# EAGLE design Adafruit MAX31850 (EAGLE 6.3)
AUTHOR: KTOWN
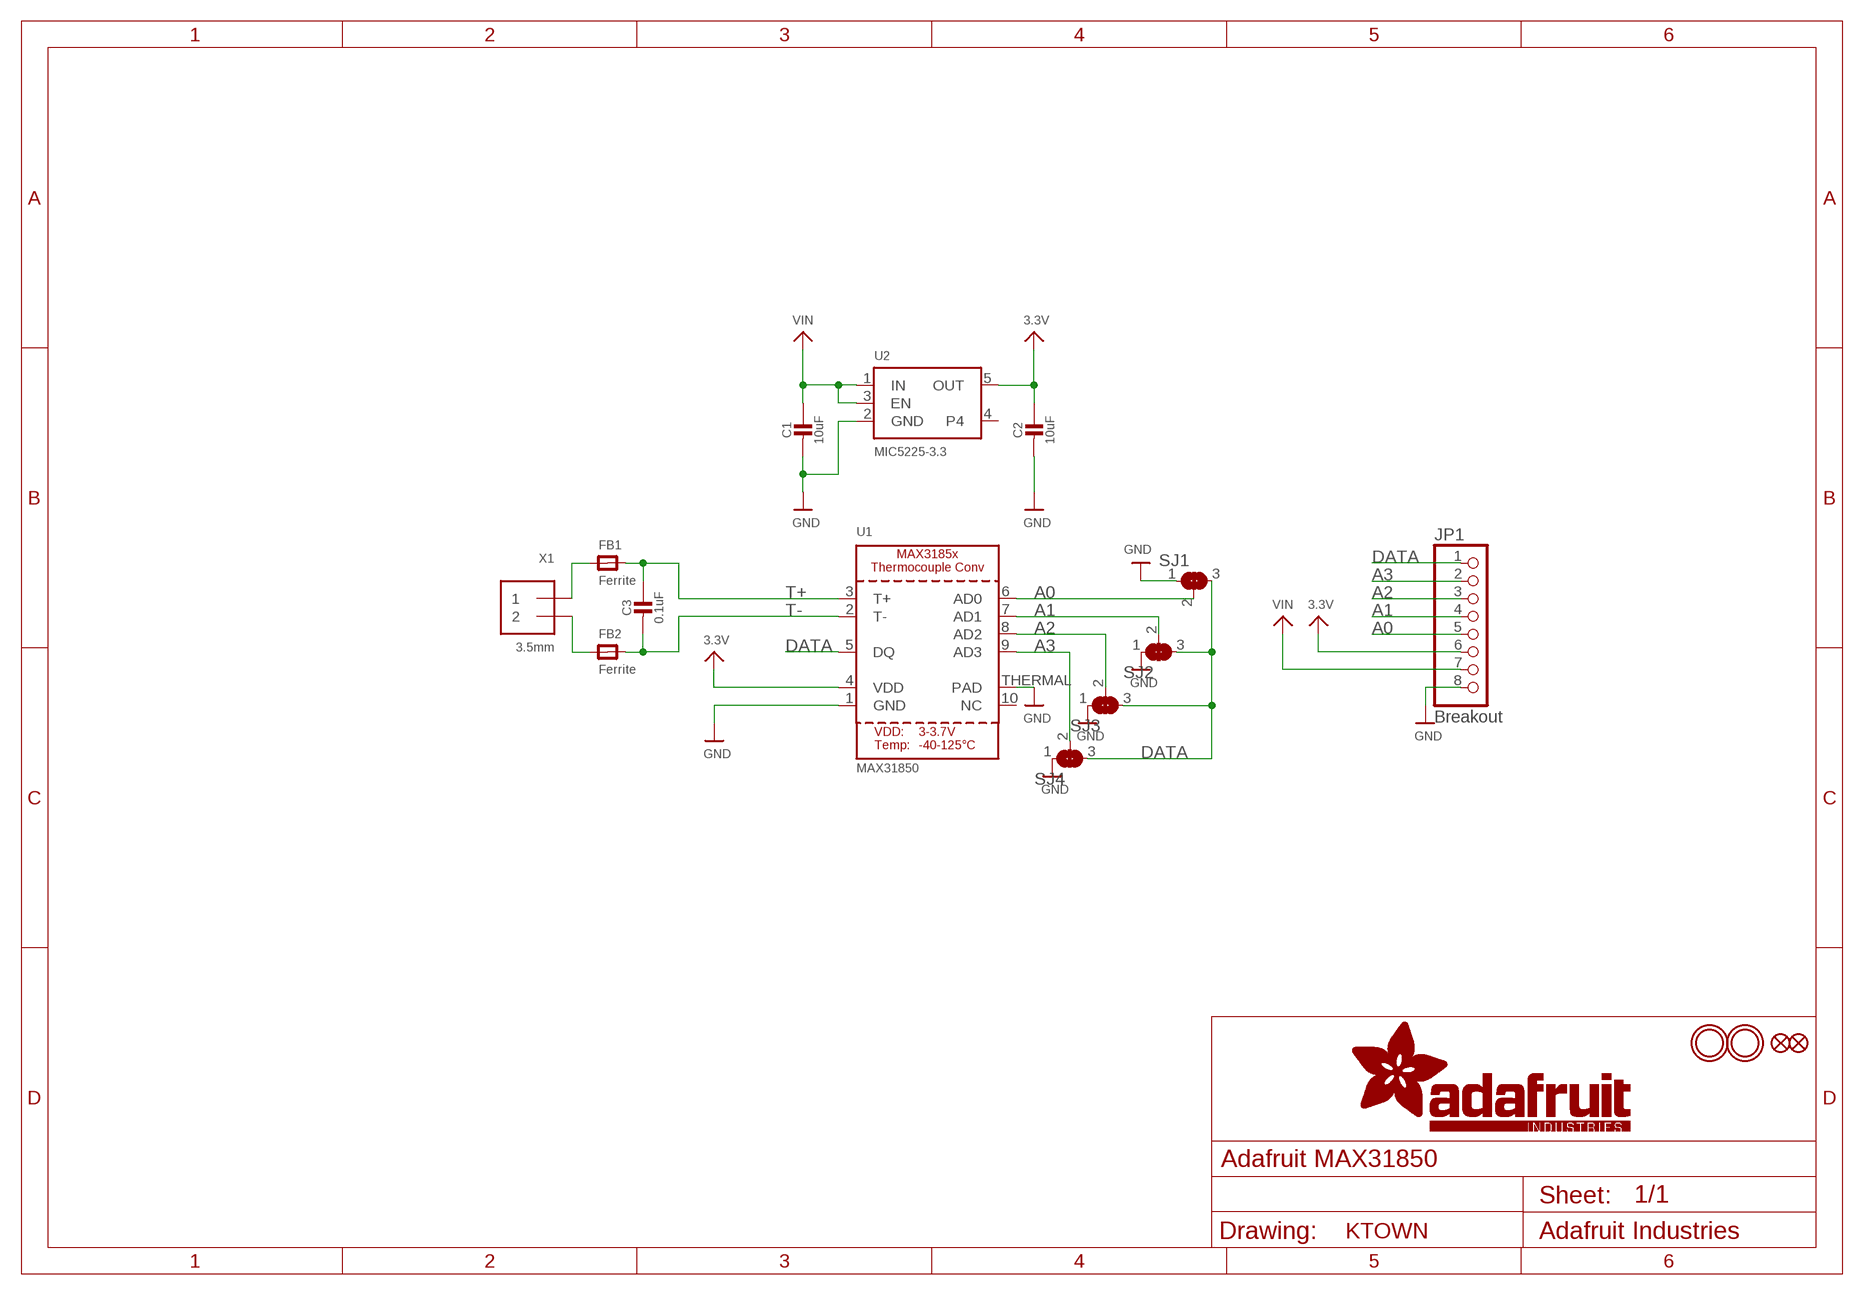
[diagram p0: schematic, sheet 1]

## Parts
C1  10uF  CAP_CERAMIC0805-NOOUTLINE  [0805-NO]
C2  10uF  CAP_CERAMIC0805-NOOUTLINE  [0805-NO]
C3  0.1uF  CAP_CERAMIC0805-NOOUTLINE  [0805-NO]
FB1  Ferrite  FERRITE0805  [0805]
FB2  Ferrite  FERRITE0805  [0805]
FID1  FIDUCIAL""  [FIDUCIAL_1MM]
FID2  FIDUCIAL""  [FIDUCIAL_1MM]
JP1  Breakout  HEADER-1X870MIL  [1X08_ROUND_70]
SJ1  SOLDERJUMPER_2WAY  [SOLDERJUMPER_2WAY_OPEN_NOPASTE]
SJ2  SOLDERJUMPER_2WAY  [SOLDERJUMPER_2WAY_OPEN_NOPASTE]
SJ3  SOLDERJUMPER_2WAY  [SOLDERJUMPER_2WAY_OPEN_NOPASTE]
SJ4  SOLDERJUMPER_2WAY  [SOLDERJUMPER_2WAY_OPEN_NOPASTE]
U1  MAX31850  MAX3185X  [TDFN10_3X4MM]
U2  MIC5225-3.3  VREG_SOT23-5  [SOT23-5]
U$8  MOUNTINGHOLE2.5  [MOUNTINGHOLE_2.5_PLATED]
U$9  MOUNTINGHOLE2.5  [MOUNTINGHOLE_2.5_PLATED]
X1  3.5mm  TERMBLOCK_1X2  [TERMBLOCK_1X2-3.5MM]

## Nets
3.3V: C2.1 JP1.6 U1.4(VDD) U2.5(OUT)
A0: JP1.5 SJ1.2 U1.6(AD0)
A1: JP1.4 SJ2.2 U1.7(AD1)
A2: JP1.3 SJ3.2 U1.8(AD2)
A3: JP1.2 SJ4.2 U1.9(AD3)
DATA: JP1.1 SJ1.3 SJ2.3 SJ3.3 SJ4.3 U1.5(DQ)
GND: C1.2 C2.2 JP1.8 SJ1.1 SJ2.1 SJ3.1 SJ4.1 U1.1(GND) U1.THERMAL(PAD) U2.2(GND)
N$1: FB1.1 X1.1
N$2: FB2.1 X1.2
T+: C3.1 FB1.2 U1.3(T+)
T-: C3.2 FB2.2 U1.2(T-)
VIN: C1.1 JP1.7 U2.1(IN) U2.3(EN)
Unconnected: U1.10(NC) U2.4

## Library data of the parts
C1-C3 = microbuilder:CAP_CERAMIC: Ceramic Capacitors For new designs, use the packages preceded by an '_' character since they are more reliable: The following footprints should be used on most boards: _0402 - Standard footprint for regular board layouts _0603 - Standard footprint for regular board layouts _0805 - Standard footprint for regular board layouts _1206 - Standard footprint for regular board layouts For extremely tight-pitch boards where space is at a premium, the following 'micro-pitch' footprints can be used (smaller pads, no silkscreen outline, etc.): _0402MP - Micro-pitch footprint for very dense/compact boards _0603MP - Micro-pitch footprint for very dense/compact boards _0805MP - Micro-pitch footprint for very dense/compact boards _1206MP - Micro-pitch footprint for very dense/compact boards
FB1 FB2 = microbuilder:FERRITE: Ferrite Bead 0603 MMZ1608B121C - 120 Ohm @ 100MHz, 600mA, 0.15 Ohm DC Resistance - Digikey: 445-2164-1-ND BK1608HW121-T - 120 Ohm, 600mA Ferrite Chip - Digikey: 587-1876-2-ND 0805 HZ0805B272R-10 - 2.7K Ohm @ 100MHz, 200mA, 0.8 Ohm DC Resistance - Digikey: 240-2504-1-ND (see also Murata BLM21BD272SN1L) MMZ2012Y152B - 1.5K Ohm @ 100MHz, 500mA, 0.4 Ohm DC Resistance - Digikey: 445-1560-1-ND - Mainly for high frequency (80-400MHz) MMZ2012R102A - 1K Ohm @ 100MHz, 500mA, 0.3 Ohm DC Resistance - Digikey: 445-1555-2-ND - More general purpose (10-200MHz)
FID1 FID2 = microbuilder:FIDUCIAL: Fiducial Alignment Points Various fiducial points for machine vision alignment.; BOM: EXCLUDE
JP1 = microbuilder:HEADER-1X8: PIN HEADER
SJ1-SJ4 = microbuilder:SOLDERJUMPER_2WAY: 2-Way Solder Jumper
U1 = microbuilder:MAX3185X: MAX31850/MAX31851 One-Wire Thermocouple to Digital Converter
U2 = microbuilder:VREG_SOT23-5: SOT23-5 Fixed Voltage Regulators Part Current Out V Out V In V Dropout θJA (°C/W) TJ (°C) Digikey Part No. ADP121 150mA 3.3V 3.4-5.5V 0.09V @ 150mA -- -- ADP121-AUJZ33R7CT-ND ADP121 150mA 3.0V 3.1-5.5V 0.09V @ 150mA -- -- ADP121-AUJZ30R7CT-ND ADP122 300mA 3.3V 3.4-5.5V 0.085V @ 300mA -- -- ADP122AUJZ-3.3-R7CT-ND ADP1712 300mA 3.3V 3.5-5.5V 0.17V @ 300mA -- -- ADP1712AUJZ-3.3-R7TR-ND AP7311 (Low Cost) 150mA 3.3V 3.5-6V 0.15V @ 150mA -- -- AP7311-33WG-7DICT-ND LD39015M18R 150mA 1.8V 1.9V-5.5V 0.08V @ 100mA -- -- 497-6977-1-ND LP2985A-33DBVR 150mA 3.3V 3.3-16V 0.28V @ 150mA 206 150 296-18479-1-ND MCP1824T-3302E/OT 300mA 3.3V 3.5V-6V 0.2V @ 300mA -- -- MCP1824T-3302E/OTCT-ND MIC5205-2.5YM5 TR 150mA 2.5V 2.7-16V 0.165V @ 150mA -- -- 576-1257-2-ND MIC5205-3.0YM5 TR 150mA 3.0V 3.2V-16V 0.165V @ 150mA -- -- 576-1258-2-ND MIC5205-3.3YM5 TR 150mA 3.3V 3.5V-16V 0.165V @ 150mA -- -- 576-1259-2-ND TPS780330220 150mA 3.3V+2.2V 3.6-5.5V 250mV Max -- -- 296-23332-1-ND TDA3663/N1,135 100mA 3.3V 3.5-45V 0.18V @ 50mA -- -- 568-5343-1-ND Max operating temp can be calculated using θJA, TJ (max junction temperature), and power in watts. Set the "Maximum Ambient Temperature" until it reaches TJ ("Max Junction Temperature"), which is the absolute limit for safe use of the regulator: Heat Sink Temperature Calculator <http://www.daycounter.com/Calculators/Heat-Sink-Temperature-Calculator.phtml> For example, With 12V source into a 3.3V LP2985 and a 30mA load, we are dissipating (12V-3.3V) * 0.03A = 0.261W. With a θJA of 206 °C/W, a TJ of 150°C, and 261mW we can safely use the chip without a heat sink up to 75°C (=147.1°C Junction Temperature).
U$8 U$9 = microbuilder:MOUNTINGHOLE: Mounting Hole For #2 screws (0.086"/2.18mm width, 0.094"/2.4mm hole) use 2.5mm; BOM: EXCLUDE
X1 = microbuilder:TERMBLOCK_1X2: 3.5mm Terminal block http://www.ladyada.net/library/pcb/eaglelibrary.html

## Board
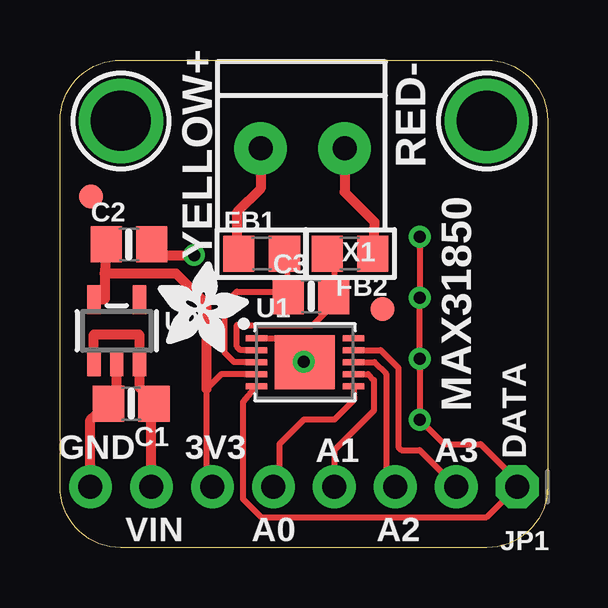
[diagram p1: board, top side]
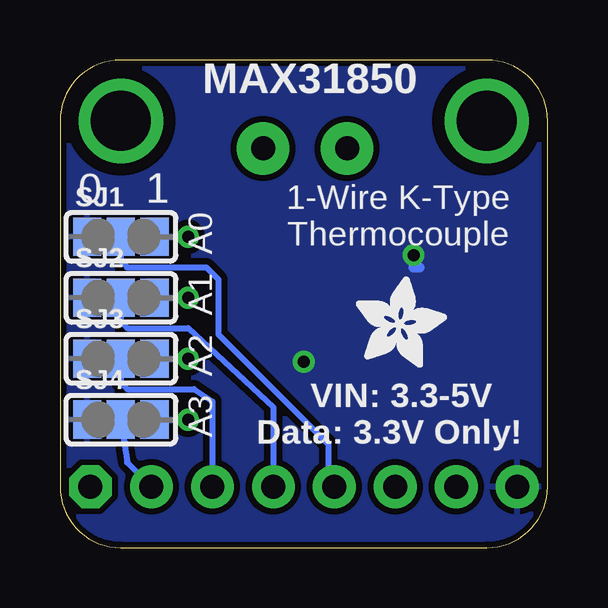
[diagram p2: board, bottom side, seen from below]

Size 20.32 x 20.32 mm. Coordinates in mm from the lower left corner, seen from the top.
Outline: 20.32,17.78 20.32,2.54 arc-90 17.78,0 2.54,0 arc-90 0,2.54 0,17.78 arc-90 2.54,20.32 17.78,20.32 arc-90 20.32,17.78
Copper layers (1*16): Top 0.035mm / dielectric 1.5mm / Bottom 0.035mm
Design rules "adafruit": minimum track width 8mil, minimum drill 15.5mil, track to track 8mil, track to pad 8mil, pad to pad 8mil, via to via 8mil, smd to smd 8mil, copper to edge 10mil, drill to drill 8mil, minimum pad ring 10mil, minimum via ring 8mil, stop-mask expansion 4mil, vias tented up to drill 20mil, thermal gap 10mil

### Footprints (pad centres in the part's own frame; a part is rotated, then mirrored left to right if it is on the bottom)
0805-NO = smd 1.3 x 1.5: 1 -0.95,0; 2 0.95,0
0805 = smd 1.3 x 1.5: 1 -0.95,0; 2 0.95,0
FIDUCIAL_1MM = smd 1 x 1: 1 0,0
1X08_ROUND_70 = drill 1 pad 1.778 octagon: 1 -8.89,0 | drill 1 pad 1.778: 2 -6.35,0; 3 -3.81,0; 4 -1.27,0; 5 1.27,0; 6 3.81,0; 7 6.35,0; 8 8.89,0
SOLDERJUMPER_2WAY_OPEN_NOPASTE = smd 1.168 x 1.6: 1 -1.397,0; 2 0,0; 3 1.397,0
TDFN10_3X4MM = smd 0.25 x 0.9: 1 -1,-2.02; 2 -0.5,-2.02; 3 0,-2.02; 4 0.5,-2.02; 5 1,-2.02; 6 1,2.02; 7 0.5,2.02; 8 0,2.02; 9 -0.5,2.02; 10 -1,2.02 | smd 2.25 x 2.5: THERMAL 0,0
SOT23-5 = smd 0.55 x 1.2: 1 -0.95,-1.3; 2 0,-1.3; 3 0.95,-1.3; 4 0.95,1.3; 5 -0.95,1.3
MOUNTINGHOLE_2.5_PLATED = drill 2.5 pad 3.2: P$1 0,0
TERMBLOCK_1X2-3.5MM = drill 1 pad 2.184: 1 1.8,0; 2 -1.7,0

### Placement (x,y rotation side)
C1  2.97,6 180 top
C2  2.87,12.64 0 top
C3  10.46,10.48 0 top
FB1  8.4,12.26 0 top
FB2  12.08,12.26 180 top
FID1  13.43,9.95 0 top
FID2  1.28,14.64 0 top
JP1  10.16,2.54 180 top
SJ1  17.78,12.95 0 bottom
SJ2  17.78,10.41 0 bottom
SJ3  17.78,7.87 0 bottom
SJ4  17.78,5.33 0 bottom
U1  10.21,7.73 270 top
U2  2.37,9.03 0 top
U$8  17.78,17.78 0 top
U$9  2.54,17.78 0 top
U$18  [ADAFRUIT_3.5MM]  8,7.49 0 bottom
U$19  [ADAFRUIT_3.5MM]  4.06,8.13 0 top
X1  10.16,16.64 180 top

### Tracks (layer width: path | path; a pad name or v marks a point on that pad's centre or on a via)
3.3V
  Top 0.254: U1.4 6.72,7.23 6.1,6.6 6.1,2.79 JP1.6
  Top 0.406: C2.1 1.86,11.43 | 1.86,11.43 1.86,10.33 U2.5 | 1.86,11.43 4.83,11.43 6.1,10.16 6.1,6.6
A0
  Top 0.254: U1.6 12.25,6.16 11.43,5.33 10.16,5.33 9.14,4.32 9.14,2.79 JP1.5
  Bottom 0.254: JP1.5 9.14,2.79 9.14,4.32 13.72,8.89 13.72,11.18 14.22,11.68 17.53,11.68 17.78,11.94 SJ1.2 19.3,12.95
A1
  Top 0.254: U1.7 12.84,7.23 13.08,6.99 13.08,5.71 11.43,4.06 JP1.4
  Bottom 0.254: SJ2.2 17.78,9.4 17.53,9.14 14.99,9.14 11.43,5.84 JP1.4
A2
  Top 0.254: U1.8 13.1,7.73 13.59,7.24 13.59,2.67 JP1.3
  Bottom 0.254: SJ3.2 17.78,6.86 17.53,6.6 14.73,6.6 13.97,6.1 JP1.3
A3
  Top 0.254: U1.9 13.36,8.23 14.1,7.49 14.1,4.19 14.22,4.06 14.99,4.06 JP1.2
  Bottom 0.254: SJ4.2 17.53,3.56 JP1.2
DATA  (via drill 0.5)
  Top 0.254: v14.99,12.95 v14.99,10.41 v14.99,7.87 v14.99,5.33 16,4.32 17.53,4.32 19.05,2.79 JP1.1 17.78,1.27 8.38,1.27 7.62,2.03 7.62,6.06 U1.5
  Bottom 0.254: SJ4.3 16.51,5.21 16.51,5.08 16.26,5.33 v14.99,5.33 | SJ3.3 v14.99,7.87 | SJ2.3 v14.99,10.41 | SJ1.3 v14.99,12.95
GND  (via drill 0.5)
  Top 0.254: U1.1 9.05,8.73 v10.16,7.75 arc-45 U1.THERMAL
  Top 0.406: JP1.8 1.27,5.32 C1.2 1.95,6.02 2.37,6.43 U2.2 | C2.2 3.89,12.19 v5.59,12.19
  Bottom 0.254: v10.16,7.75 10.41,7.62
  Bottom 0.406: v5.59,12.19 5.59,11.68 5.33,11.68
  pour Bottom (isolate 0.254): 20.41,21 20.41,0 2.54,0 arc-90 0,2.54 0,21
N$1
  Top 0.406: X1.1 8.36,14.96 7.37,13.97 7.37,12.4 FB1.1
N$2
  Top 0.406: X1.2 11.86,14.81 13.1,13.57 FB2.1
N$3
  Bottom 0.254: 18.03,10.41 19.05,10.41
N$4
  Bottom 0.254: 18.03,7.87 19.05,7.87
N$5
  Bottom 0.254: 18.03,5.33 19.05,5.33
T+
  Top 0.254: U1.3 7.26,7.73 6.86,8.13 6.86,10.16 7.37,10.67 9.38,10.67 C3.1 9.44,12.36 FB1.2
T-
  Top 0.254: U1.2 7.52,8.23 7.37,8.38 7.37,9.27 10.54,9.27 11.43,10.16 11.43,10.68 C3.2 11.48,12.23 FB2.2
VIN
  Top 0.406: JP1.7 3.81,5.83 C1.1 3.32,6.67 U2.3 3.3,7.73 3.3,8.89 1.42,8.89 U2.1

### Text on the board
tPlace: RED- | YELLOW+ | MAX31850 | DATA | GND | 3V3 | A1 | A3 | VIN | A0 | A2
bPlace: MAX31850 | 1-Wire K-Type / Thermocouple | A0 | 1 | 0 | A1 | A2 | VIN: 3.3-5V | A3 | Data: 3.3V Only!